# Altium schematic sheet Option_PMIC_RK818.SchDoc
size 420 x 297 mm
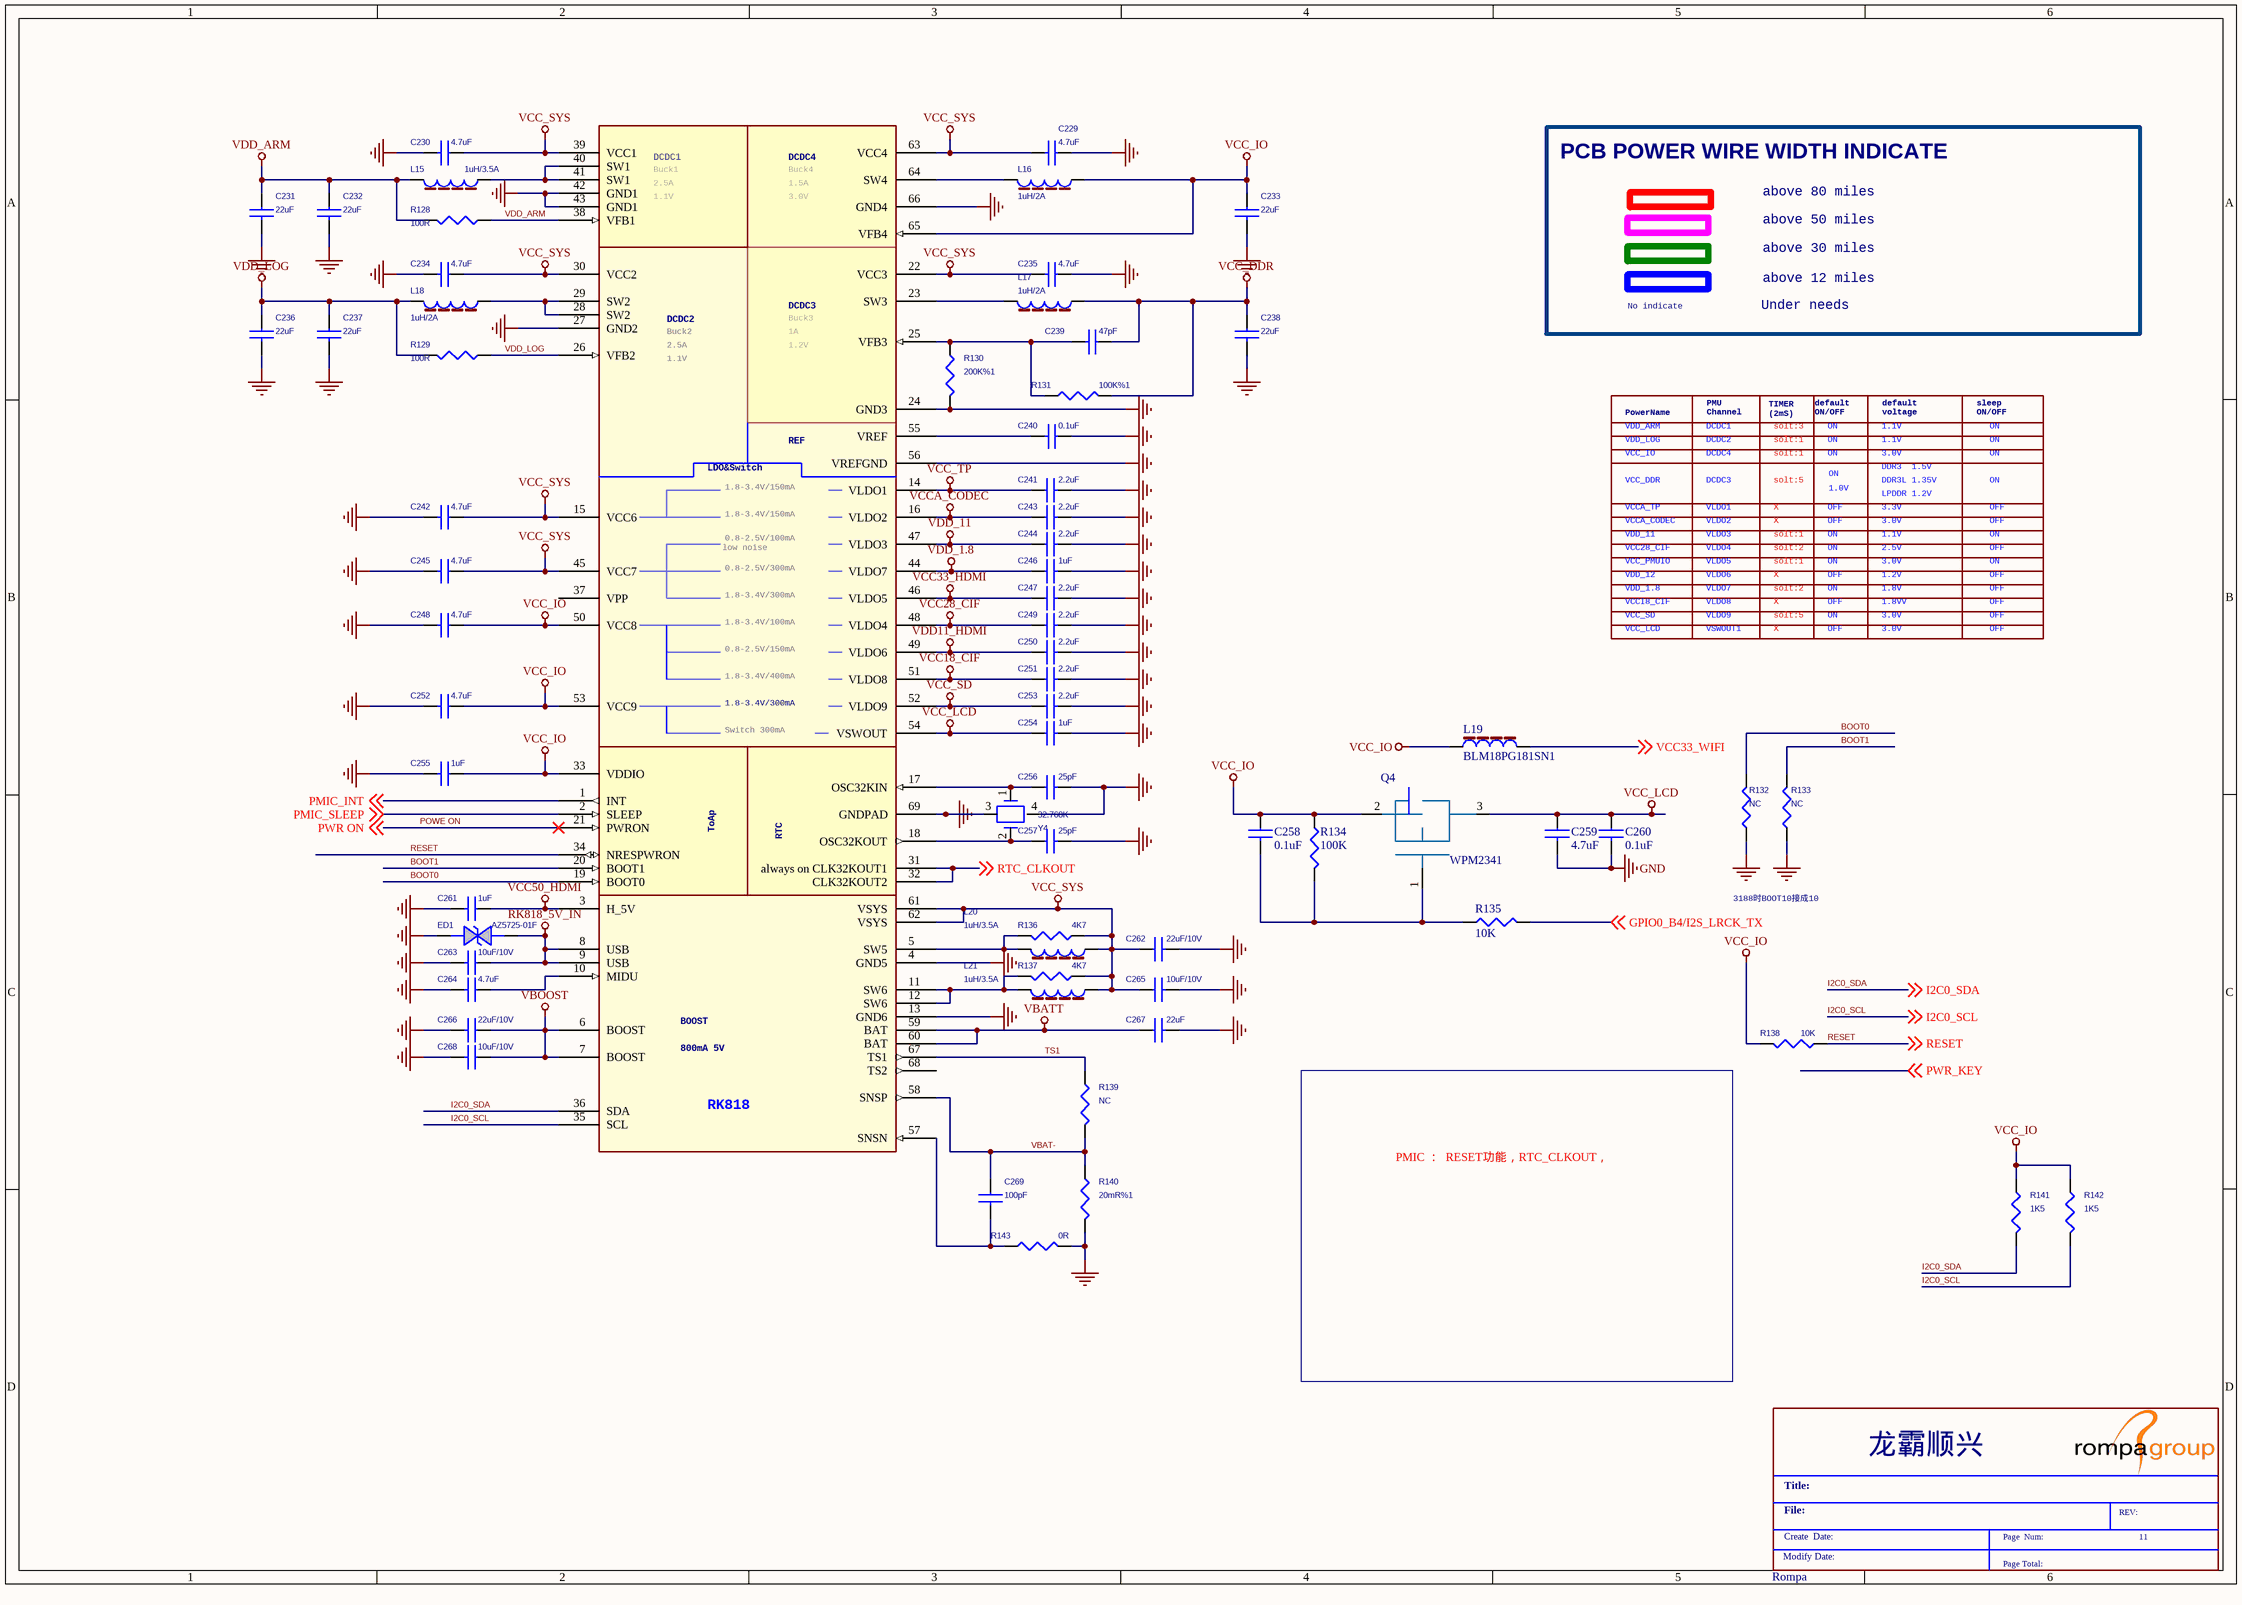
[diagram p0: Option_PMIC_RK818.SchDoc]

## Parts
*  Rompa  Schematic Page Number: 11  (graphical)
C229  4.7uF  [C0603]
C230  4.7uF  [C0603]
C231  22uF  [C0805]
C232  22uF  [C0805]
C233  22uF  [C0805]
C234  4.7uF  [C0603]
C235  4.7uF  [C0603]
C236  22uF  [C0805]
C237  22uF  [C0805]
C238  22uF  [C0805]
C239  47pF  [C0402]
C240  0.1uF  [C0402]
C241  2.2uF  [C0402]
C242  4.7uF  [C0603]
C243  2.2uF  [C0402]
C244  2.2uF  [C0402]
C245  4.7uF  [C0603]
C246  1uF  [C0402]
C247  2.2uF  [C0402]
C248  4.7uF  [C0603]
C249  2.2uF  [C0402]
C250  2.2uF  [C0402]
C251  2.2uF  [C0402]
C252  4.7uF  [C0603]
C253  2.2uF  [C0402]
C254  1uF  [C0402]
C255  1uF  [C0402]
C256  25pF  [C0402]
C257  25pF  [C0402]
C258  0.1uF  [C0402]
C259  4.7uF  [C0402]
C260  0.1uF  [C0402]
C261  1uF  [C0402]
C262  22uF/10V  [C1206]
C263  10uF/10V  [C0805]
C264  4.7uF  [C0603]
C265  10uF/10V  [C0805]
C266  22uF/10V  [C1206]
C267  22uF  [C0805]
C268  10uF/10V  [C0805]
C269  100pF  [C0402]
ED1  AZ5725-01F  [E0402]
L15  1uH/3.5A  [IND-4X4]
L16  1uH/2A  [IND-3X3]
L17  1uH/2A  [IND-3X3]
L18  1uH/2A  [IND-3X3]
L19  BLM18PG181SN1  [L0603]
L20  1uH/3.5A  [IND-4X4]
L21  1uH/3.5A  [IND-4X4]
Q4  WPM2341  [SOT23]
R128  100R  [R0402]
R129  100R  [R0402]
R130  200K%1  [R0402]
R131  100K%1  [R0402]
R132  NC  [R0402]
R133  NC  [R0402]
R134  100K  [R0402]
R135  10K  [R0402]
R136  4K7  [R0402]
R137  4K7  [R0402]
R138  10K  [R0402]
R139  NC  [R0402]
R140  20mR%1  [R1210]
R141  1K5  [R0402]
R142  1K5  [R0402]
R143  0R  [R0402]
U19  RK818  [QFN68]  (value not drawn)
Y4  32.768K  [CRY_MC146]

## Nets
GND: C229.1 C230.2 C231.2 C232.2 C233.2 C234.2 C235.1 C236.2 C237.2 C238.2 C240.1 C241.2 C242.2 C243.2 C244.2 C245.2 C246.2 C247.2 C248.2 C249.2 C250.2 C251.2 C252.2 C253.2 C254.2 C255.2 C256.2 C257.2 C259.2 C260.2 C261.2 C262.2 C263.2 C264.2 C265.2 C266.2 C267.2 C268.2 ED1.1 R130.1 R132.2 R133.2 R140.2 R143.2 U19.4(GND5) U19.13(GND6) U19.24(GND3) U19.27(GND2) U19.42(GND1) U19.43(GND1) U19.56(VREFGND) U19.66(GND4) U19.69(GNDPAD) Y4.3 Y4.4
RK818_5V_IN: C263.1 ED1.2 U19.8(USB) U19.9(USB)
VBATT: C267.1 U19.59(BAT) U19.60(BAT)
VBOOST: C266.1 C268.1 U19.6(BOOST) U19.7(BOOST)
VCC18_CIF: C251.1 U19.51(VLDO8)
VCC28_CIF: C249.1 U19.48(VLDO4)
VCC33_HDMI: C247.1 U19.46(VLDO5)
VCC50_HDMI: C261.1 U19.3(H_5V)
VCC_DDR: C238.1 C239.1 L17.2 R131.1
VCC_IO: C233.1 C248.1 C252.1 C255.1 C258.1 L16.2 L19.1 R134.1 R138.1 R141.1 R142.1 U19.33(VDDIO) U19.50(VCC8) U19.53(VCC9) U19.65(VFB4)
VCC_LCD: C254.1 C259.1 C260.1 U19.54(VSWOUT)
VCC_SD: C253.1 U19.52(VLDO9)
VCC_SYS: C229.2 C230.1 C234.1 C235.2 C242.1 C245.1 C262.1 C265.1 L20.2 L21.2 R136.1 R137.1 U19.15(VCC6) U19.22(VCC3) U19.30(VCC2) U19.39(VCC1) U19.45(VCC7) U19.61(VSYS) U19.62(VSYS) U19.63(VCC4)
VCC_TP: C241.1 U19.14(VLDO1)
VCCA_CODEC: C243.1 U19.16(VLDO2)
VDD11_HDMI: C250.1 U19.49(VLDO6)
VDD_1.8: C246.1 U19.44(VLDO7)
VDD_11: C244.1 U19.47(VLDO3)
VDD_ARM: C231.1 C232.1 L15.1 R128.1 R128.2 U19.38(VFB1)
VDD_LOG: C236.1 C237.1 L18.1 R129.1 R129.2 U19.26(VFB2)
BOOT0: R132.1 U19.19(BOOT0)
BOOT1: R133.1 U19.20(BOOT1)
GPIO0_B4/I2S_LRCK_TX: R135.2 ; off-sheet GPIO0_B4/I2S_LRCK_TX
I2C0_SCL: R142.2 U19.35(SCL) ; off-sheet I2C0_SCL
I2C0_SDA: R141.2 U19.36(SDA) ; off-sheet I2C0_SDA
PMIC_INT: U19.1(INT) ; off-sheet PMIC_INT
PMIC_SLEEP: U19.2(SLEEP) ; off-sheet PMIC_SLEEP
POWE ON: U19.21(PWRON) ; off-sheet PWR ON  [also labelled PWR ON]
RESET: R138.2 U19.34(NRESPWRON) ; off-sheet RESET
RTC_CLKOUT: U19.31(always_on_CLK32KOUT1) U19.32(CLK32KOUT2) ; off-sheet RTC_CLKOUT
TS1: R139.1 U19.67(TS1)
VBAT-: C269.1 R139.2 R140.1 U19.58(SNSP)
VCC33_WIFI: L19.2 ; off-sheet VCC33_WIFI
NetC239_2: C239.2 R130.2 R131.2 U19.25(VFB3)
NetC240_2: C240.2 U19.55(VREF)
NetC256_1: C256.1 U19.17(OSC32KIN) Y4.1
NetC257_1: C257.1 U19.18(OSC32KOUT) Y4.2
NetC258_2: C258.2 Q4.1 R134.2 R135.1
NetC264_1: C264.1 U19.10(MIDU)
NetC269_2: C269.2 R143.1 U19.57(SNSN)
NetL15_2: L15.2 U19.40(SW1) U19.41(SW1)
NetL16_1: L16.1 U19.64(SW4)
NetL17_1: L17.1 U19.23(SW3)
NetL18_2: L18.2 U19.28(SW2) U19.29(SW2)
NetL20_1: L20.1 R136.2 U19.5(SW5)
NetL21_1: L21.1 R137.2 U19.11(SW6) U19.12(SW6)

Not connected (* = marked no-connect by the designer): Q4 2 3; U19 37(VPP) 68(TS2)

## Notes on the sheet
- PCB POWER WIRE WIDTH INDICATE
- above 30 miles
- above 50 miles
- above 80 miles
- No indicate
- Under needs
- above 12 miles
- VDD_ARM
- VCC_IO
- VDD_LOG
- PowerName
- PMU
  Channel
- DCDC4
- DCDC1
- DCDC2
- TIMER
  (2mS)
- solt:1
- solt:3
- default
  ON/OFF
- ON
- 1.1V
- default
  voltage
- 3.0V
- sleep
  ON/OFF
- VCC_DDR
- VCCA_TP
- VCCA_CODEC
- DCDC3
- VLDO2
- VLDO1
- solt:5
- X
- OFF
- 1.0V
- 3.3V
- DDR3  1.5V
- LPDDR 1.2V
- DDR3L 1.35V
- VDD_11
- VCC_PMUIO
- VCC28_CIF
- VDD_12
- VDD_1.8
- VLDO4
- VLDO5
- VLDO3
- VLDO7
- VLDO6
- solt:2
- 1.2V
- 1.8V
- 2.5V
- VCC_SD
- VCC_LCD
- VCCI8_CIF
- VSWOUT1
- VLDO8
- VLDO9
- 1.8VV
- 3188时BOOT10接成10
- (near U19) RK818
- PMIC ：  RESET功能，RTC_CLKOUT，
- (in symbol RK818_1) DCDC1; DCDC4; Buck1; Buck4; 2.5A; 1.5A; 1.1V; 3.0V; DCDC3; Buck3; DCDC2; Buck2; 1A; 1.2V; REF; LDO&Switch; 1.8-3.4V/150mA; 0.8-2.5V/100mA; low noise; 0.8-2.5V/300mA; 1.8-3.4V/300mA; 1.8-3.4V/100mA; 0.8-2.5V/150mA; 1.8-3.4V/400mA; Switch 300mA; ToAp; RTC; 800mA 5V
- (in symbol Rompa) 龙霸顺兴; Title:; File:; REV:; Create  Date:; Page  Num:; Modify Date:; Page Total:

## Library data of the parts
C229-C257 C261-C269 = CAP NP_4
C258-C260 = CAP NP
ED1 = DIODE BI-DIR TRIG: ESD
L15-L18 L20 L21 = INDUCTOR_2: ROOM: USB+5V
L19 = INDUCTOR_2
R128-R133 R136-R138 = RESISTOR_1: RES,thick film,47KOhm,+/-5%,1/16W,SMD0402
R134 R135 = RESISTOR
R139 R143 = RESISTOR_1: 贴片电阻; ROOM: USB+5V; MARK: 2K
R140 = RESISTOR_1: 贴片电阻; MARK: 2K; ROOM: USB+5V
R141 R142 = RES 1B: ROHS CHIP RES 4.7K 1/16W 5%
U19 = RK818_1
Y4 = CRYSTAL_0: Crystal,32.768KHz,+/-30ppm,12pF,MC146,-10°C ~ +60   °C; Part Type: 晶体类\无源晶体